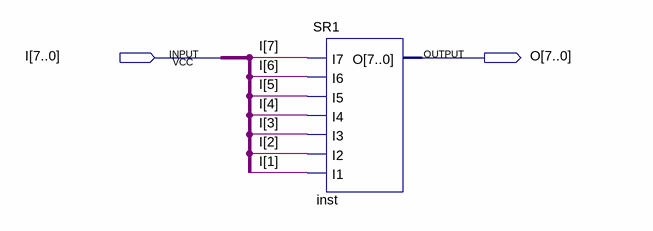
[diagram p0: schematic sheet]
// Quartus schematic 8ShiftRight1.bdf as structural Verilog: 1 symbols, 2 pins
module \8ShiftRight1  (
  input  [7:0] I,
  output [7:0] O
);

  SR1 inst (.I7(I[7]), .I6(I[6]), .I5(I[5]), .I4(I[4]), .I3(I[3]), .I2(I[2]), .I1(I[1]), .O(O));
endmodule
